# EAGLE design RCShield-v1 (EAGLE 5.07)
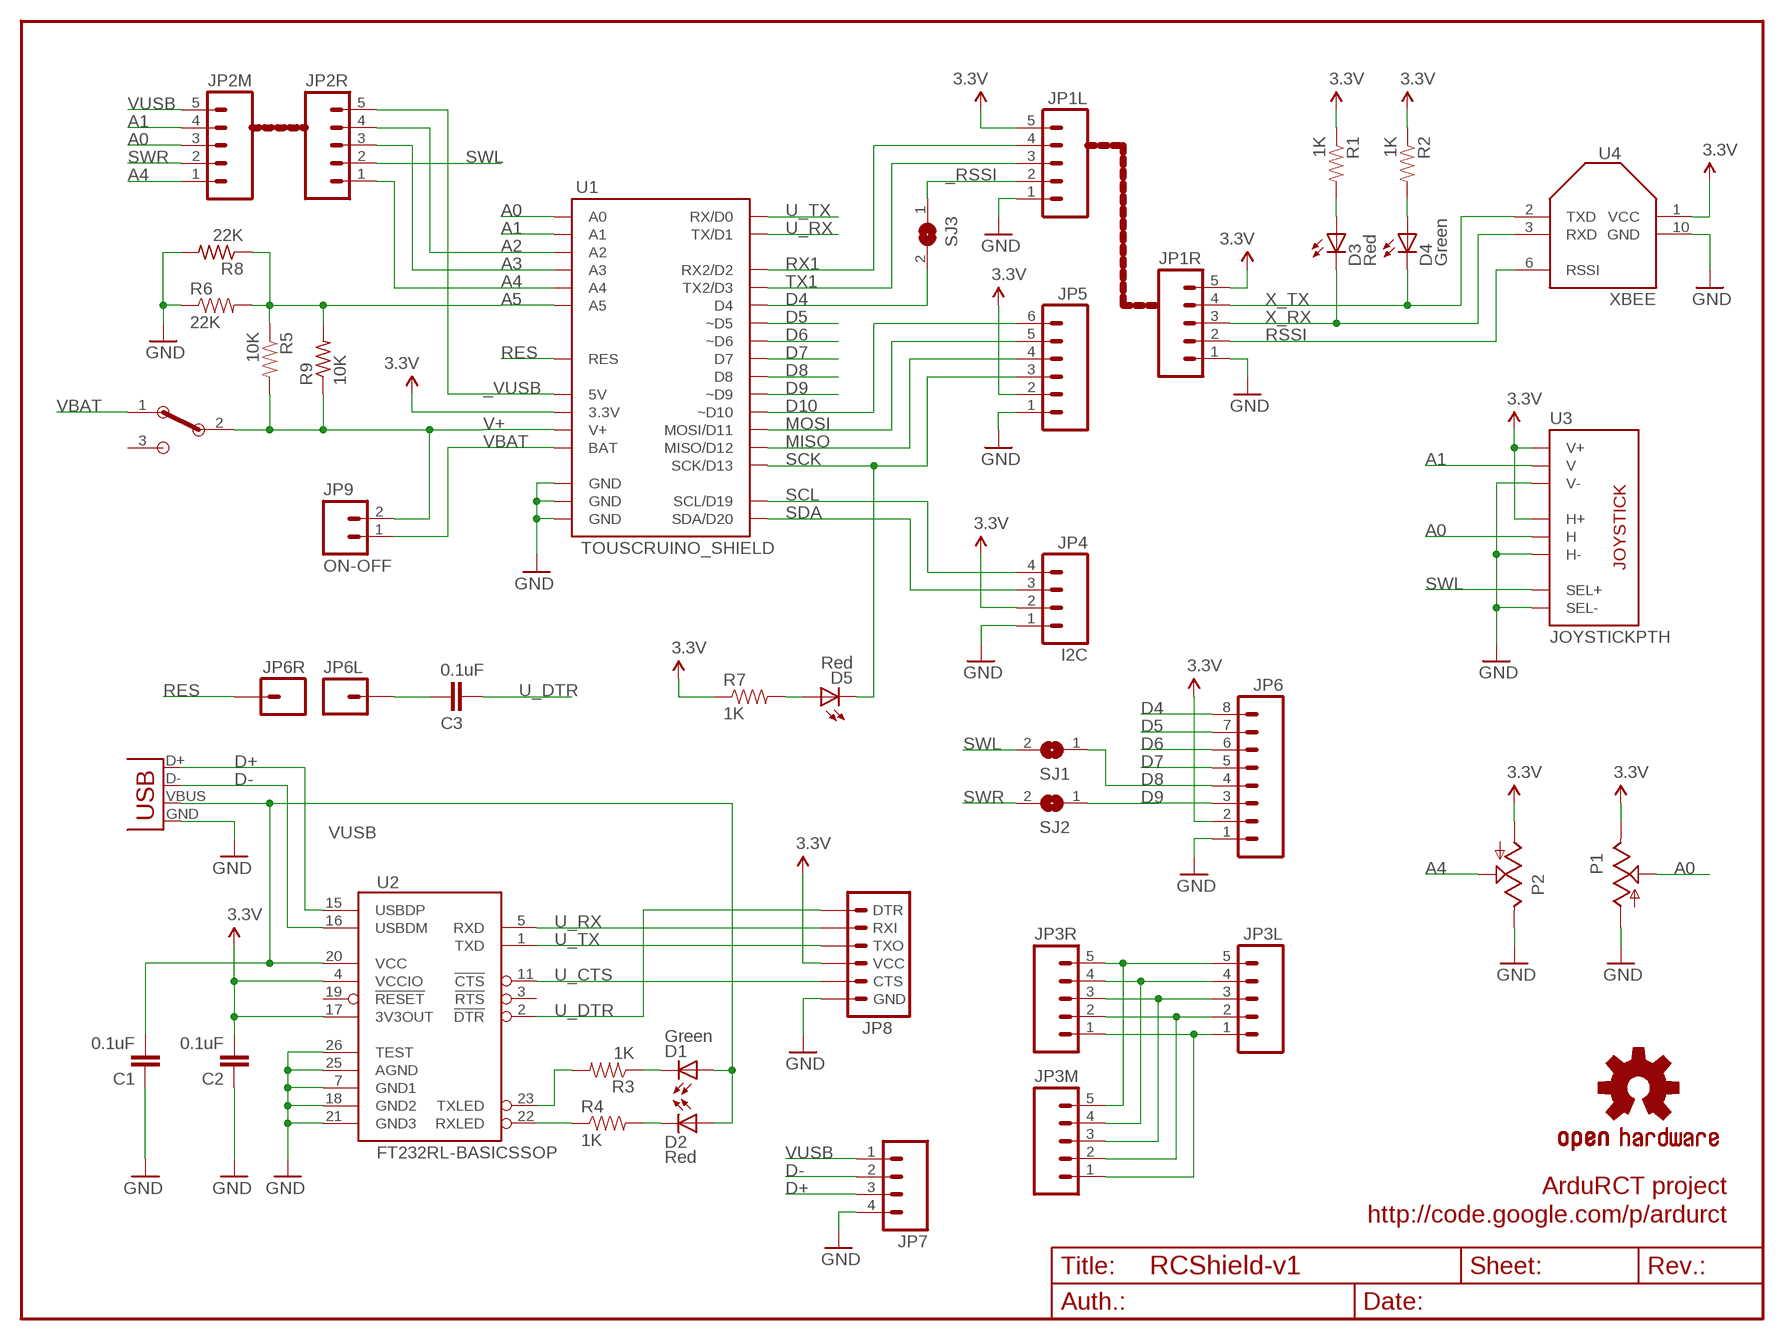
[diagram p0: schematic, sheet 1]

## Parts
C1  0.1uF  CAP0805  [0805]
C2  0.1uF  CAP0805  [0805]
C3  0.1uF  CAP0805  [0805]
D1  Green  LED  [LED]
D2  Red  LED  [LED]
D3  Red  LED  [LED]
D4  Green  LED  [LED]
D5  Red  LED  [LED]
JP1L  M05  [2+3]
JP1R  M05  [2+3]
JP2M  M05  [2+3]
JP2R  M05  [2+3]
JP3L  M05  [2+3]
JP3M  M05  [2+3]
JP3R  M05  [2+3]
JP4  I2C  M04  [1X04]
JP5  M06SIP  [1X06]
JP6  M08  [1X08]
JP6L  M01PTH  [1X01]
JP6R  M01PTH  [1X01]
JP7  M04  [1X04]
JP8  ARDUINO_SERIAL_PROGRAM  [1X06_F]
JP9  ON-OFF  M02  [1X02]
P1  POT  [ALPS_POT]
P2  POT  [ALPS_POT]
R1  1K  RESISTOR0805-RES  [0805]
R2  1K  RESISTOR0805-RES  [0805]
R3  1K  RESISTOR0805-RES  [0805]
R4  1K  RESISTOR0805-RES  [0805]
R5  10K  RESISTOR0805-RES  [0805]
R6  22K  RESISTOR0805-RES  [0805]
R7  1K  RESISTOR0805-RES  [0805]
R8  22K  R-US_0207/7  [0207/7]
R9  10K  R-US_0207/7  [0207/7]
S4  EG1224  [EG1224]
SJ1  SJ  [SJ]
SJ2  SJ  [SJ]
SJ3  SJ  [SJ]
U1  TOUSCRUINO_SHIELD  TOUSCRUINO_SHIELDSPLIT  [TOUSCRUINO_SHIELD_SPLIT]
U2  FT232RL-BASICSSOP  [SSOP28DB]
U3  JOYSTICKPTH  [JOYSTICK]
U4  XBEE  XBEE-RSSI  [XBEE-SMD]
U$1  OSHW-LOGOM  [OSHW-LOGO-M]
X1  USBSMD  [USB-MINIB]

## Nets
3.3V: C2.2 JP1L.5 JP1R.5 JP4.2 JP5.2 JP6.2 JP8.4(VCC) P1.P$1(E) P2.P$3(A) R1.1 R2.1 R7.1 U1.3.3V U2.4(VCCIO) U2.17(3V3OUT) U3.H1(H+) U3.V1(V+) U4.1(VCC)
_RSSI: JP1L.2 SJ3.1
_VUSB: JP2R.5 U1.5V
A0: JP2M.3 P1.P$2(S) U1.A0 U3.H2(H)
A1: JP2M.4 U1.A1 U3.V2(V)
A2: JP2R.4 U1.A2
A3: JP2R.3 U1.A3
A4: JP2M.1 JP2R.1 P2.P$2(S) U1.A4
A5: R5.1 R6.2 R8.1 R9.2 U1.A5
D4: JP6.8 SJ3.2 U1.D4
D5: JP6.7 U1.D5(~D5)
D6: JP6.6 U1.D6(~D6)
D7: JP6.5 U1.D7
D8: JP6.4 SJ1.1 U1.D8
D9: JP6.3 SJ2.1 U1.D9(~D9)
D10: JP5.6 U1.D10(~D10)
D+: JP7.3 U2.15(USBDP) X1.D+
D-: JP7.2 U2.16(USBDM) X1.D-
GND [vcc]: C1.1 C2.1 JP1L.1 JP1R.1 JP4.1 JP5.1 JP6.1 JP7.4 JP8.6(GND) P1.P$3(A) P2.P$1(E) R6.1 R8.2 U1.GND@0(GND) U1.GND@1(GND) U1.GND@2(GND) U2.7(GND1) U2.18(GND2) U2.21(GND3) U2.25(AGND) U2.26(TEST) U3.B2A(SEL-) U3.H3(H-) U3.V3(V-) U4.10(GND) X1.GND
MISO: JP5.4 U1.D12(MISO/D12)
MOSI: JP5.5 U1.D11(MOSI/D11)
N$4: JP3L.4 JP3M.4 JP3R.4
N$5: JP3L.3 JP3M.3 JP3R.3
N$6: JP3L.2 JP3M.2 JP3R.2
N$7: JP3L.5 JP3M.5 JP3R.5
N$8: D5.A1(A) R7.2
N$11: C3.2 JP6L.1
N$14: D3.A1(A) R1.2
N$18: R3.2 U2.23(TXLED)
N$22: R4.1 U2.22(RXLED)
N$25: D4.A1(A) R2.2
RES: JP6R.1 U1.RES
RSSI: JP1R.2 U4.6(RSSI)
RX1: JP1L.4 U1.D2(RX2/D2)
SCK: D5.C1(C) JP5.3 U1.D13(SCK/D13)
SCL: JP4.4 U1.SCL(SCL/D19)
SDA: JP4.3 U1.SDA(SDA/D20)
SWL: JP2R.2 SJ1.2 U3.B1A(SEL+)
SWR: JP2M.2 SJ2.2
TX1: JP1L.3 U1.D3(TX2/D3)
U_CTS: JP8.5(CTS) U2.11(!CTS)
U_DTR: C3.1 JP8.1(DTR) U2.2(!DTR)
U_RX: JP8.2(RXI) U1.TX(TX/D1) U2.5(RXD)
U_RX_LED: D2.C1(C) R4.2
U_TX: JP8.3(TXO) U1.RX(RX/D0) U2.1(TXD)
U_TX_LED: D1.C1(C) R3.1
V+: JP9.2 R5.2 R9.1 S4.2 U1.V+
VBAT: JP9.1 S4.1 U1.BAT
VGND [vcc]: JP3L.1 JP3M.1 JP3R.1
VUSB: C1.2 D1.A1(A) D2.A1(A) JP2M.5 JP7.1 U2.20(VCC) X1.VBUS
X_RX: D3.C1(C) JP1R.3 U4.3(RXD)
X_TX: D4.C1(C) JP1R.4 U4.2(TXD)
Unconnected: S4.3 U2.3(!RTS) U2.19(!RESET)

## Notes on the sheet
- ArduRCT project
- http://code.google.com/p/ardurct

## Library data of the parts
C1-C3 = SparkFun:CAP: Capacitor Standard 0603 ceramic capacitor, and 0.1" leaded capacitor.
D1-D5 = wibauxl:LED
JP1L JP1R JP2M JP2R JP3L JP3M JP3R = wibauxl:M05
JP4 JP7 = wibauxl:M04
JP5 = SparkFun:M06: Header 6 Standard 6-pin 0.1" header. Use with straight break away headers (SKU : PRT-00116), right angle break away headers (PRT-00553), swiss pins (PRT-00743), machine pins (PRT-00117), and female headers (PRT-00115). Molex polarized connector foot print use with SKU : PRT-08094 with associated crimp pins and housings. NOTES ON THE VARIANTS LOCK and LOCK_LONGPADS... This footprint was designed to help hold the alignment of a through-hole component (i.e. 6-pin header) while soldering it into place. You may notice that each hole has been shifted either up or down by 0.005 of an inch from it's more standard position (which is a perfectly straight line). This slight alteration caused the pins (the squares in the middle) to touch the edges of the holes. Because they are alternating, it causes a "brace" to hold the component in place. 0.005 has proven to be the perfect amount of "off-center" position when using our standard breakaway headers. Although looks a little odd when you look at the bare footprint, once you have a header in there, the alteration is very hard to notice. Also, if you push a header all the way into place, it is covered up entirely on the bottom side. This idea of altering the position of holes to aid alignment will be further integrated into the Sparkfun Library for other footprints. It can help hold any component with 3 or more connection pins.
JP6 = wibauxl:M08
JP6L JP6R = SparkFun:M01: Header 1 Standard 1-pin 0.1" header. Use with straight break away headers (SKU : PRT-00116), right angle break away headers (PRT-00553), swiss pins (PRT-00743), machine pins (PRT-00117), and female headers (PRT-00115).
JP8 = wibauxl:ARDUINO_SERIAL_PROGRAM
JP9 = wibauxl:M02
P1 P2 = SparkFun:POT
R1-R7 = SparkFun:RESISTOR: Resistor Basic schematic elements and footprints for 0603, 1206, and PTH resistors.
R8 R9 = resistor:R-US_: RESISTOR, American symbol
S4 = wibauxl:EG1224
SJ1-SJ3 = jumper:SJ: SMD solder JUMPER
U1 = wibauxl:TOUSCRUINO_SHIELD
U2 = wibauxl:FT232RL-BASIC: USB UART This is the simplified version of the FT232RL unit. Only what you need, nothing you don't. Spark Fun Electronics SKU : COM-00650
U3 = SparkFun:JOYSTICK: Thumb Joystick Joystick commonly found in PS2 controllers. Two pots and a select switch. Footprint proven. Spark Fun Electronics SKU : COM-09032
U4 = wibauxl:XBEE-RSSI
U$1 = SparkFun:OSHW-LOGO: Open Source Hardware Logo This logo indicates the piece of hardware it is found on incorporates a OSHW license and/or adheres to the definition of open source hardware found here: http://freedomdefined.org/OSHW
X1 = SparkFun:USB: USB Connectors USB-B-PTH is fully proven SKU : PRT-00139 USB-miniB is fully proven SKU : PRT-00587 USB-A-PCB is untested. USB-A-H is throughly reviewed, but untested. Spark Fun Electronics SKU : PRT-00437 USB-B-SMT is throughly reviewed, but untested. Needs silkscreen touching up. USB-A-S has not been used/tested USB-MB-H has not been used/tested

## Net classes
0 default: width 0.203 mm
1 vcc: width 0.254 mm

## Board
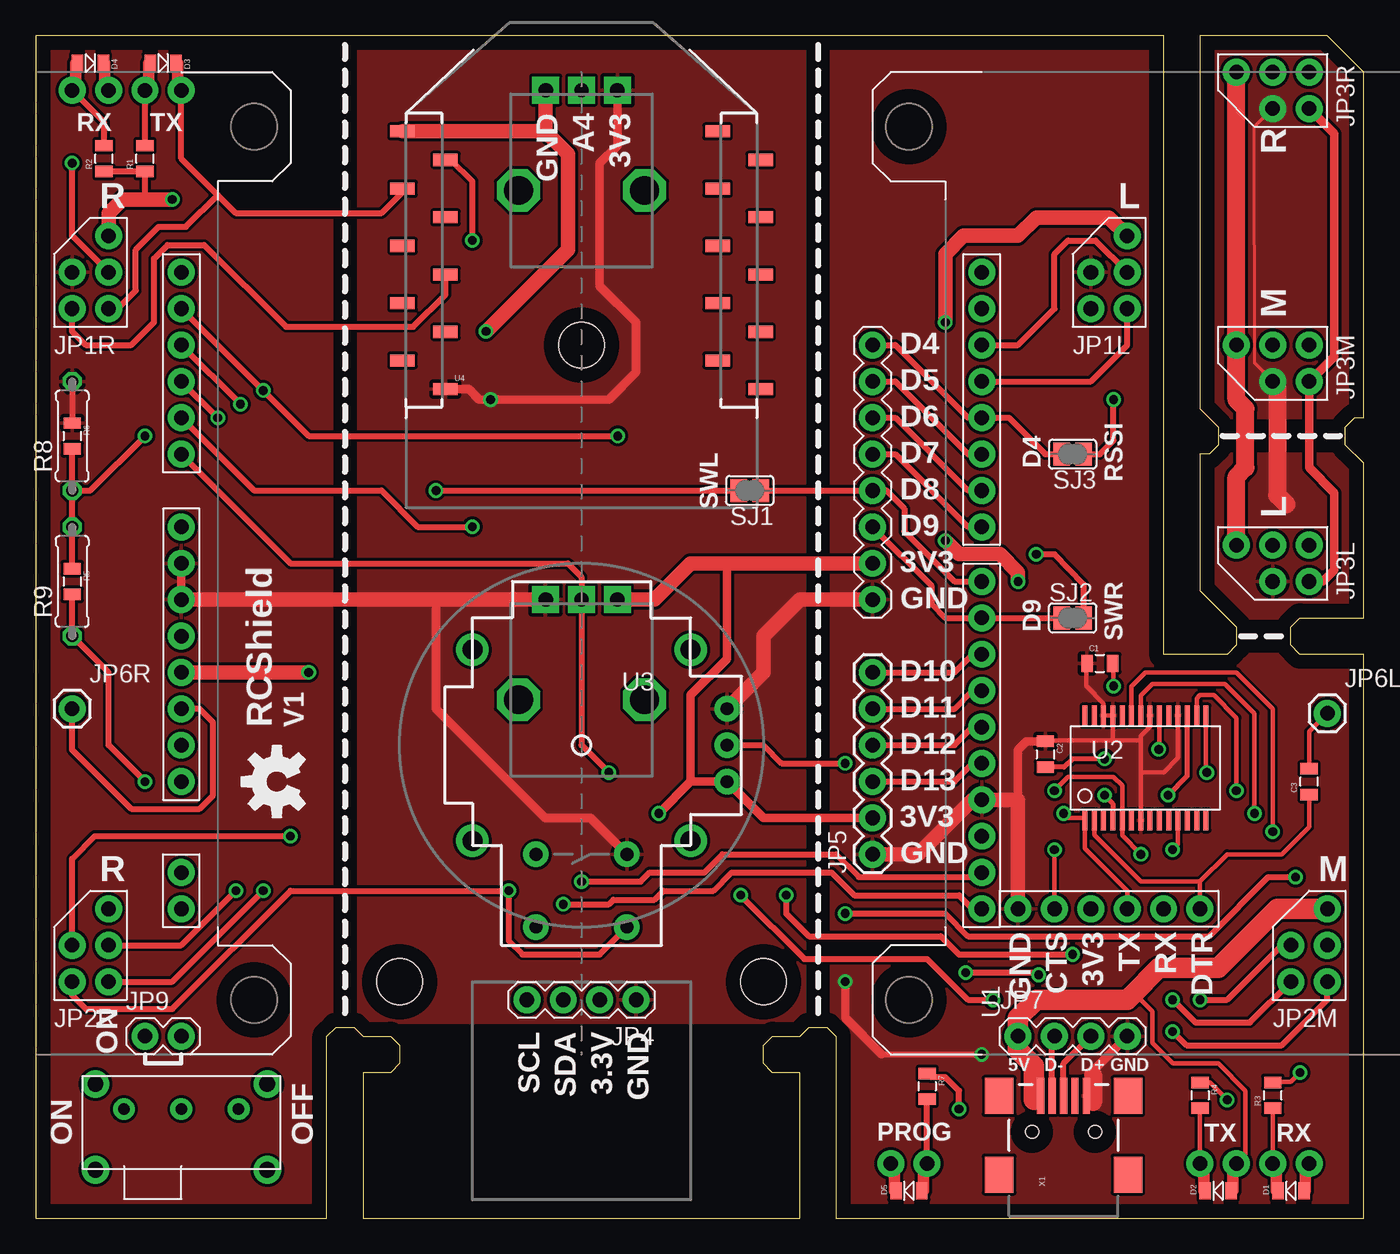
[diagram p1: board, top side]
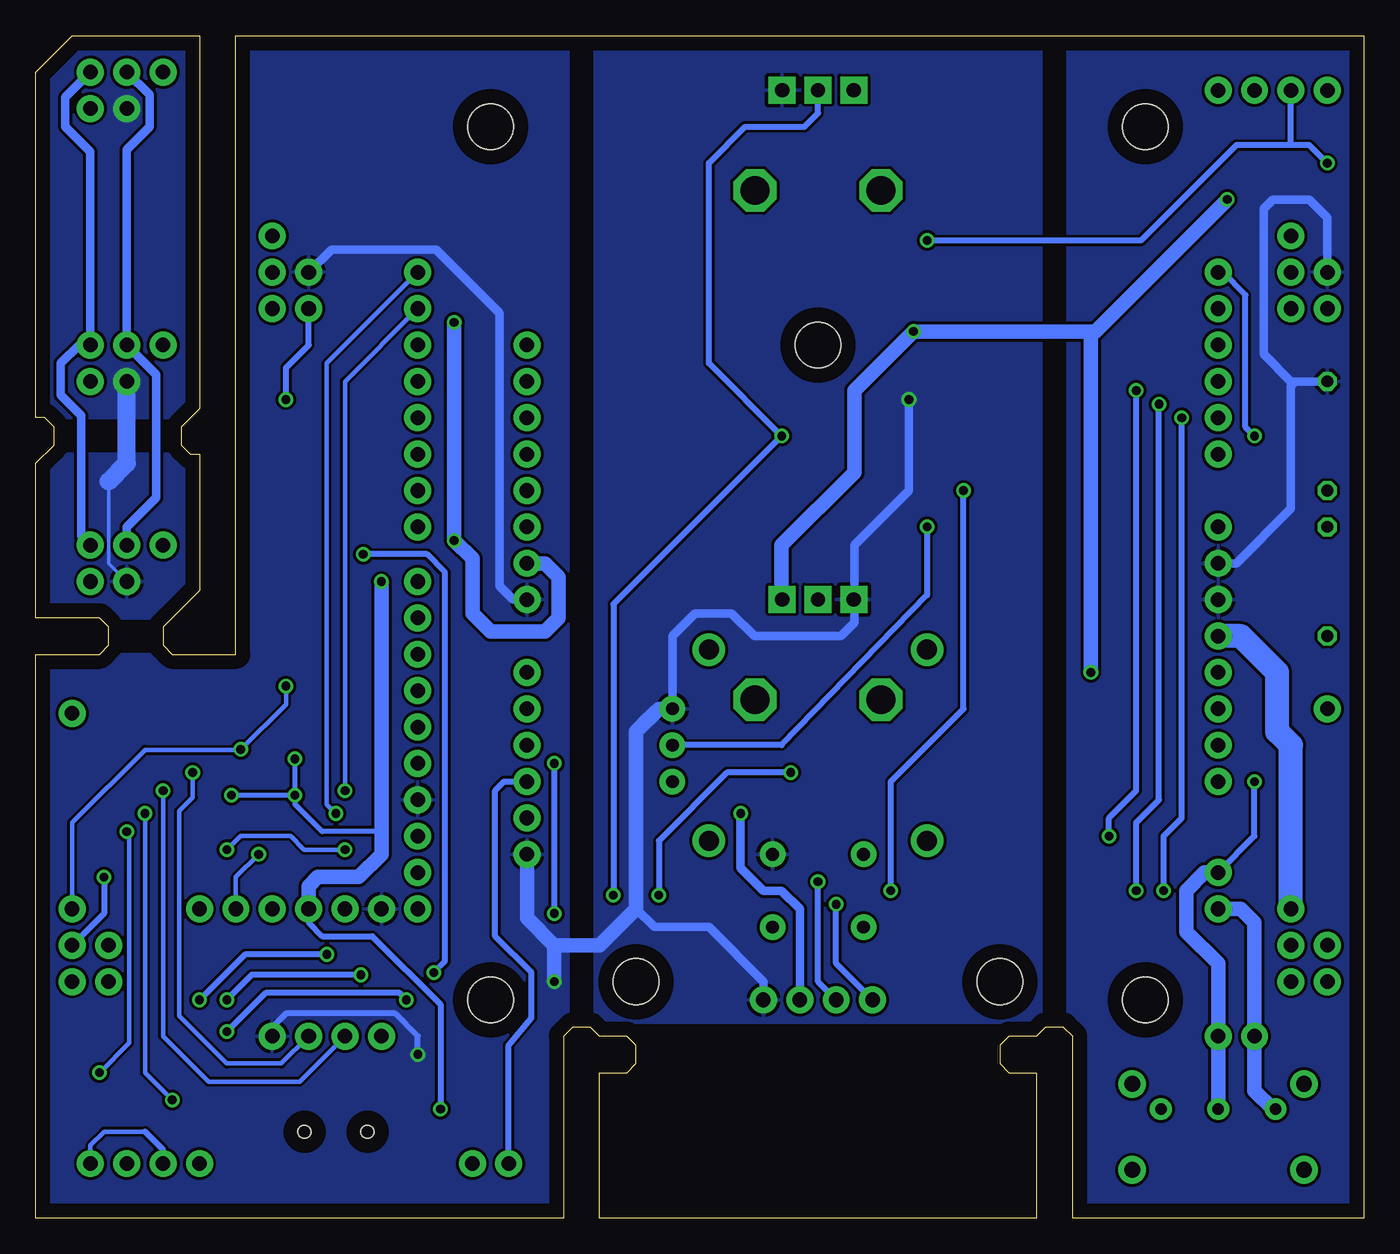
[diagram p2: board, bottom side, seen from below]

Size 92.71 x 82.55 mm. Coordinates in mm from the lower left corner, seen from the top.
Outline: 0,0 20.32,0 20.32,12.7 20.95,13.34 22.23,13.34 22.86,12.7 24.77,12.7 25.4,12.06 25.4,10.79 24.77,10.16 22.86,10.16 22.86,0 53.34,0 53.34,10.16 51.44,10.16 50.8,10.79 50.8,12.06 51.44,12.7 53.34,12.7 53.98,13.34 55.24,13.34 55.88,12.7 55.88,0 92.7,0 92.71,39.37 88.27,39.37 87.63,40.01 87.63,41.27 88.27,41.91 92.71,41.91 92.71,52.7 91.44,53.98 91.44,55.24 92.08,55.88 92.71,55.88 92.71,80.01 90.17,82.55 81.28,82.54 81.28,56.52 82.55,55.24 82.55,53.98 81.92,53.34 81.28,53.34 81.28,43.81 83.82,41.27 83.82,40.01 83.19,39.37 78.74,39.37 78.74,82.55 20.64,82.55 20.32,82.54 0,82.54 0,0
Copper layers (1*16): Top 0.035mm / dielectric 1.5mm / Bottom 0.035mm
Design rules "default *": minimum track width 10mil, minimum drill 24mil, track to track 8mil, track to pad 8mil, pad to pad 8mil, via to via 8mil, smd to smd 8mil, copper to edge 40mil, drill to drill 8mil, minimum pad ring 10mil, minimum via ring 8mil, stop-mask expansion 4mil, vias tented up to drill 0mil, thermal gap 10mil
Holes 3.2 mm at 15.24,15.24 60.96,15.24 60.96,76.2 15.24,76.2 50.8,16.51 25.4,16.51 38.1,60.96

### Footprints (pad centres in the part's own frame; a part is rotated, then mirrored left to right if it is on the bottom)
0805 = smd 0.8 x 1.2: 1 -0.9,0; 2 0.9,0
LED = smd 0.8 x 1.2: A -0.9,0; C 0.9,0 | drill 1.016 pad 1.88 round: A1 -1.27,-1.905; C1 1.27,-1.905
2+3 = drill 1.016 pad 1.88 round: 1 -1.27,0; 2 1.27,0; 3 1.27,2.54; 4 -1.27,2.54; 5 -3.81,2.54
1X04 = drill 1.016 pad 1.88 round: 1 0,0; 2 2.54,0; 3 5.08,0; 4 7.62,0
1X06 = drill 1.016 pad 1.88 round: 1 0,0; 2 2.54,0; 3 5.08,0; 4 7.62,0; 5 10.16,0; 6 12.7,0
1X08 = drill 1.016 pad 1.88 round: 1 0,0; 2 2.54,0; 3 5.08,0; 4 7.62,0; 5 10.16,0; 6 12.7,0; 7 15.24,0; 8 17.78,0
1X01 = drill 1.016 pad 1.88 round: 1 0,0
1X06_F = drill 1.016 pad 1.88 round: 1 0,0; 2 2.54,0; 3 5.08,0; 4 7.62,0; 5 10.16,0; 6 12.7,0
1X02 = drill 1.016 pad 1.88 round: 1 0,0; 2 2.54,0
ALPS_POT = drill 1 pad 1.88 square: P$1 7,-2.5; P$2 7,0; P$3 7,2.5 | drill 2 octagon: P$4 0,-4.4; P$5 0,4.4
0207/7 = drill 0.813 octagon: 1 -3.81,0; 2 3.81,0
EG1224 = drill 0.8 pad 1.524 round: 1 -4,0; 2 0,0; 3 4,0 | drill 1.1 pad 1.93 round: P$4 6,1.75; P$5 -6,1.75; P$6 -6,-4.25; P$7 6,-4.25
SJ = smd 1.168 x 1.6: 1 -0.762,0; 2 0.762,0
TOUSCRUINO_SHIELD_SPLIT = drill 1.016 pad 1.88 round: 3.3V -27.94,-8.89; 5V -27.94,-6.35; A0 -27.94,6.35; A1 -27.94,8.89; A2 -27.94,11.43; A3 -27.94,13.97; A4 -27.94,16.51; A5 -27.94,19.05; AREF 27.94,-20.32; BAT -27.94,-25.4; D2 27.94,13.97; D3 27.94,11.43; D4 27.94,8.89; D5 27.94,6.35; D6 27.94,3.81; D7 27.94,1.27; D8 27.94,-2.54; D9 27.94,-5.08; D10 27.94,-7.62; D11 27.94,-10.16; D12 27.94,-12.7; D13 27.94,-15.24; GND@0 -27.94,-3.81; GND@1 -27.94,-1.27; GND@2 27.94,-17.78; IOREF -27.94,-13.97; NC -27.94,-16.51; RES -27.94,-11.43; RX 27.94,19.05; SCL 27.94,-25.4; SDA 27.94,-22.86; TX 27.94,16.51; V+ -27.94,-22.86; VIN -27.94,1.27
SSOP28DB = smd 0.348 x 1.397: 1 -4.225,-3.656; 2 -3.575,-3.656; 3 -2.925,-3.656; 4 -2.275,-3.656; 5 -1.625,-3.656; 6 -0.975,-3.656; 7 -0.325,-3.656; 8 0.325,-3.656; 9 0.975,-3.656; 10 1.625,-3.656; 11 2.275,-3.656; 12 2.925,-3.656; 13 3.575,-3.656; 14 4.225,-3.656; 15 4.225,3.656; 16 3.575,3.656; 17 2.925,3.656; 18 2.275,3.656; 19 1.625,3.656; 20 0.975,3.656; 21 0.325,3.656; 22 -0.325,3.656; 23 -0.975,3.656; 24 -1.625,3.656; 25 -2.275,3.656; 26 -2.925,3.656; 27 -3.575,3.656; 28 -4.225,3.656
JOYSTICK = drill 0.9 pad 1.778 round: B1A -3.175,12.7; B1B 3.175,12.7; B2A -3.175,7.62; B2B 3.175,7.62 | drill 0.889 pad 1.778 round: H1 -2.54,-10.16; H2 0,-10.16; H3 2.54,-10.16; V1 -10.16,2.54; V2 -10.16,0; V3 -10.16,-2.54 | drill 1.397 pad 2.286 round: MOUNT1 -7.62,6.668; MOUNT2 -7.62,-6.668; MOUNT3 7.62,-6.668; MOUNT4 7.62,6.668
XBEE-SMD = smd 1.7 x 0.85: 1 -12.5,20; 2 -9.5,18; 3 -12.5,16; 4 -9.5,14; 5 -12.5,12; 6 -9.5,10; 7 -12.5,8; 8 -9.5,6; 9 -12.5,4; 10 -9.5,2; 11 12.5,2; 12 9.5,4; 13 12.5,6; 14 9.5,8; 15 12.5,10; 16 9.5,12; 17 12.5,14; 18 9.5,16; 19 12.5,18; 20 9.5,20
USB-MINIB = smd 2.5 x 0.5: D+ 2.5,0; D- 2.5,0.8; GND 2.5,-1.6; ID 2.5,-0.8; VBUS 2.5,1.6 | smd 2.5 x 2: MTN1 -3,4.5; MTN2 2.5,4.5; MTN3 -3,-4.5; MTN4 2.5,-4.5 | hole 0.9: 0,2.2; 0,-2.2

### Placement (x,y rotation side)
C1  74.3,38.73 0 top
C2  70.48,32.38 270 top
C3  88.9,30.48 90 top
D1  87.63,1.91 180 top
D2  82.55,1.91 180 top
D3  8.89,80.64 0 top
D4  3.81,80.64 0 top
D5  60.96,1.91 180 top
JP1L  73.66,64.77 270 top
JP1R  2.54,64.77 270 top
JP2M  87.63,17.78 270 top
JP2R  2.54,17.78 270 top
JP3L  87.63,44.45 0 top
JP3M  87.63,58.42 0 top
JP3R  87.63,77.47 0 top
JP4  41.91,15.24 180 top
JP5  58.42,25.4 90 top
JP6  58.42,43.18 90 top
JP6L  90.17,35.24 0 top
JP6R  2.54,35.56 0 top
JP7  68.58,12.7 0 top
JP8  81.28,21.59 180 top
JP9  7.62,12.7 0 top
P1  38.1,36.2 90 top
P2  38.1,71.75 90 top
R1  7.62,73.98 90 top
R2  4.76,73.98 90 top
R3  86.36,8.57 90 top
R4  81.28,8.57 270 top
R5  2.54,44.45 270 top
R6  2.54,54.61 270 top
R7  62.23,9.21 270 top
R8  2.54,54.61 90 top
R9  2.54,44.45 90 top
S4  10.16,7.62 0 top
SJ1  49.85,50.8 180 top
SJ2  72.39,41.91 0 top
SJ3  72.39,53.34 180 top
U1  38.1,46.99 0 top
U2  77.47,31.43 0 top
U3  38.1,33.02 180 top
U4  38.1,55.88 0 top
U$1  16.83,30.48 90 top
X1  71.75,6.03 90 top

### Tracks (layer width: path | path; a pad name or v marks a point on that pad's centre or on a via)
3.3V  (via drill 0.61)
  Top 0.356: U2.17 80.39,30.86 v79.06,29.53 | C2.2 71.81,31.48 72.39,32.07 v74.61,32.07 | U2.4 75.19,28.95 v74.61,29.53
  Top 0.406: R2.1 R1.1 7.62,71.12 6.03,71.12 | v64.45,7.62 64.45,8.89 63.5,9.84 62.49,9.84 R7.1 61.97,10.16 | P1.P$1 40.62,43.2 U3.H1
  Top 0.61: JP5.2 50.8,27.94 U3.V1 45.72,30.48 | 45.72,30.48 45.72,36.51 48.26,39.05 48.26,45.72 | 45.72,30.48 v43.5,28.26
  Top 1.016: JP1L.5 74.93,69.85 69.85,69.85 68.58,68.58 64.77,68.58 63.5,67.31 v63.5,62.55 | U1.3.3V v19.05,38.1 | JP1R.5 5.08,70.17 6.03,71.12 v9.53,71.12 | 35.56,75.88 U4.1 | 35.56,75.88 37.15,74.3 37.15,67.63 v31.43,61.91 | JP6.2 48.26,45.72 45.72,45.72 43.18,43.18 U3.H1 | P2.P$3 35.6,75.92 35.56,75.88 | v63.5,47.31 64.45,46.35 67.31,46.35 68.58,45.09 v68.58,44.45
  Bottom 0.356: v74.61,29.53 v79.06,29.53 | v74.61,29.53 v74.61,32.07 | v74.61,29.53 74.61,28.89 72.71,26.99 68.58,26.99
  Bottom 0.406: JP8.4 73.66,20.64 72.71,19.68 69.22,19.68 64.45,14.92 v64.45,7.62
  Bottom 0.61: JP4.2 39.37,21.59 40.64,22.86 41.91,22.86 43.5,24.45 v43.5,28.26
  Bottom 1.016: v19.05,38.1 19.05,61.91 | 19.05,61.91 v31.43,61.91 35.56,57.78 35.56,52.07 40.64,46.99 U3.H1 | 19.05,61.91 18.73,61.91 v9.53,71.12 | v63.5,62.55 v63.5,47.31 62.23,46.04 62.23,42.23 60.96,40.96 57.15,40.96 56.2,41.91 56.2,44.77 57.15,45.72 JP6.2 | v68.58,44.45 68.58,26.99 68.58,25.4 70.17,23.81 73.03,23.81 73.66,23.18 JP8.4
_RSSI  (via drill 0.61)
  Top 0.406: SJ3.1 73.47,53.78 73.34,53.34 74.3,53.34 75.25,54.29 v75.25,57.15
  Bottom 0.406: v75.25,57.15 75.25,59.37 73.66,60.96 JP1L.2
_VUSB
  Bottom 1.676: U1.5V 8.57,40.64 6.03,38.1 6.03,33.97 5.08,33.02 JP2R.5
A0  (via drill 0.61)
  Top 0.406: JP2M.3 90.17,15.24 87,12.06 80.33,12.06 v79.38,13.02 | v66.83,15.24 65.09,15.24 62.23,18.1 53.66,18.1 v49.21,22.54 | U1.A0 17.78,45.72 37.15,45.72 38.1,44.77 U3.H2 | v40.01,31.11 38.1,33.02 U3.H2 | U3.H2 P1.P$2
  Bottom 0.406: v79.38,13.02 76.68,15.72 67.31,15.72 v66.83,15.24 | v49.21,22.54 49.21,26.35 44.45,31.11 v40.01,31.11
A1  (via drill 0.61)
  Top 0.406: v87.95,23.81 86.04,23.81 81.92,19.68 65.09,19.68 63.5,21.27 v56.52,21.27 | U3.V2 50.8,33.02 52.07,31.75 v56.52,31.75 | v30.48,48.26 26.67,48.26 24.13,50.8 15.24,50.8 U1.A1
  Bottom 0.406: JP2M.4 87.95,21.27 v87.95,23.81 | v56.52,31.75 v56.52,21.27 | U3.V2 40.64,33.02 30.48,43.5 v30.48,48.26
A2  (via drill 0.61)
  Top 0.406: JP2R.4 10.16,19.05 v13.97,22.86 | v12.7,55.88 U1.A2
  Bottom 0.406: v13.97,22.86 13.97,26.67 12.7,27.94 v12.7,55.88
A3  (via drill 0.61)
  Top 0.406: JP2R.3 9.53,16.51 v15.88,22.86 | v14.29,56.83 U1.A3
  Bottom 0.406: v15.88,22.86 15.88,27.62 14.29,29.21 v14.29,56.83
A4  (via drill 0.61)
  Top 0.406: U1.A4 v15.88,57.78 19.05,54.61 v40.64,54.61 | JP2M.1 87,19.05 83.19,15.24 v81.28,15.24 | v72.39,18.41 64.45,18.41 63.18,19.68 53.98,19.68 52.39,21.27 v52.39,22.54 | v17.78,26.67 4.13,26.67 2.54,25.08 JP2R.1
  Bottom 0.406: v72.39,18.41 78.11,18.41 v81.28,15.24 | v17.78,26.67 17.78,27.94 15.88,29.84 v15.88,57.78 | P2.P$2 38.1,77.15 39.05,76.2 43.18,76.2 45.72,73.66 45.72,59.69 v40.64,54.61 52.39,42.86 v52.39,22.54
A5  (via drill 0.61)
  Top 0.406: v7.62,54.61 3.81,50.8 R8.1 | R8.1 R9.2 R5.1 | R8.1 R6.2
  Bottom 0.406: U1.A5 9.84,66.04 8.26,64.45 8.26,55.24 v7.62,54.61
D4
  Top 0.406: JP6.8 60.01,60.96 65.09,55.88 U1.D4 67.94,55.88 70.48,53.34 SJ3.2
D5
  Top 0.406: U1.D5 65.09,53.34 60.01,58.42 JP6.7
D6
  Top 0.406: U1.D6 65.09,50.8 60.01,55.88 JP6.6
D7
  Top 0.406: U1.D7 65.09,48.26 60.01,53.34 JP6.5
D8
  Top 0.406: U1.D8 64.14,44.45 60.64,47.94 60.64,49.53 59.37,50.8 JP6.4 SJ1.1
D9
  Top 0.406: JP6.3 62.55,44.13 62.55,42.86 63.5,41.91 U1.D9 SJ2.1
D10
  Top 0.406: JP5.6 64.14,38.1 65.41,39.37 U1.D10
D+  (via drill 0.61)
  Top 0.305: 81.69,35.15 U2.15 81.69,31.18 v81.76,31.11
  Top 0.406: X1.D+ 71.75,10.79 JP7.3
  Bottom 0.305: v81.76,31.11 81.76,29.37 82.07,29.05 82.71,28.42 82.71,24.29 82.71,14.13 79.38,10.79 75.56,10.79 JP7.3
D-  (via drill 0.61)
  Top 0.305: U2.16 81.05,36.28 81.28,36.51 82.23,36.51 83.82,34.92 v83.82,29.84
  Top 0.406: X1.D- 70.95,12.54 JP7.2
  Bottom 0.305: v83.82,29.84 83.82,12.7 80.64,9.53 74.3,9.53 JP7.2
GND  (via drill 0.61)
  Top 0.305: 77.15,33.34 77.15,33.66 77.8,34.3 U2.21 | C2.1 70.54,33.34 75.25,33.34 | 75.25,33.34 75.19,33.39 U2.25 U2.26 74.55,35.95 73.34,37.15 73.34,38.47 C1.1 | X1.GND 73.62,8.53 73.82,8.1 | 75.25,33.34 77.15,33.34 | 77.14,31.11 77.14,33.33 77.15,33.34 | 77.14,31.11 U2.7 | U2.18 79.75,32.12 78.74,31.11 77.14,31.11
  Top 0.406: 59.05,11.43 v66.04,11.43 | R8.2 R6.1
  Top 0.61: C2.1 69.16,33.28 68.58,32.7 68.58,29.21 | v56.52,16.51 56.52,13.97 59.05,11.43 | U1.GND@0 U1.GND@1 | P2.P$1 40.6,74.89 39.37,73.66 39.37,65.09 41.91,62.55 41.91,59.05 40.01,57.15 v31.75,57.15 30.96,57.15 30.26,57.88 28.89,57.88 | U3.B2A 38.73,27.94 35.56,27.94 27.94,35.56 27.94,43.18 | 34,43.18 U3.H3 | 28.89,57.88 U4.10 28.8,57.88 28.89,57.78 | 28.89,57.88 28.89,57.78 | 28.89,57.78 28.57,57.78 | 73.82,10 73.82,10.32 JP7.4
  Top 1.016: JP5.1 61.59,25.4 65.41,29.21 U1.GND@2 68.58,29.21 JP8.6 | JP6.1 53.34,43.18 50.8,40.64 50.8,38.1 U3.V3 | P1.P$3 34,43.18 27.94,43.18 U1.GND@0
  Top 1.27: 73.82,10 73.82,8.1
  Bottom 0.406: v66.04,11.43 66.04,12.7 67.63,14.29 75.25,14.29 76.2,13.34 JP7.4
  Bottom 0.61: JP1L.1 72.07,67.63 64.77,67.63 60.33,63.18 60.33,44.13 59.37,43.18 JP6.1 | U1.GND@1 8.89,45.72 5.08,49.53 5.08,58.1 4.76,58.42 R8.2 5.08,58.42 6.99,60.33 6.99,70.48 6.35,71.12 3.81,71.12 2.54,69.85 JP1R.1 | v31.75,57.15 31.75,50.8 35.56,46.99 U3.H3 | JP4.1 41.91,16.51 45.72,20.32 49.53,20.32 50.8,21.59 | 50.8,33.97 50.48,34.61 49.53,35.56 U3.V3 48.26,40.64 46.67,42.23 44.13,42.23 42.55,40.64 36.51,40.64 35.56,41.59 35.56,43.16 P1.P$3
  Bottom 1.016: 56.52,19.05 58.42,20.95 JP5.1 | U3.V3 49.21,35.56 50.8,33.97 50.8,21.59 53.34,19.05 56.52,19.05 | 56.52,19.05 v56.52,16.51
  pour Top: 0,82.55 20.64,82.55 20.64,0 0,0
  pour Bottom: 0,82.55 20.64,82.55 20.64,0 0,0
  pour Top: 22.54,82.55 53.66,82.55 53.66,13.65 22.54,13.65
  pour Top: 55.56,82.55 78.74,82.55 78.74,39.37 92.71,39.37 92.71,0 55.56,0
  pour Bottom: 55.56,82.55 78.74,82.55 78.74,39.37 92.71,39.37 92.71,0 55.56,0
  pour Bottom: 22.54,82.55 53.66,82.55 53.66,13.65 22.54,13.65
MISO
  Top 0.406: JP5.4 64.14,33.02 65.41,34.29 U1.D12
MOSI
  Top 0.406: JP5.5 64.14,35.56 65.41,36.83 U1.D11
N$4
  Bottom 0.61: JP3R.4 84.77,78.42 84.77,76.2 86.36,74.61 JP3M.4 84.3,58.9 84.3,56.99 84.3,51.28 84.3,50.32 85.72,48.9 86.36,48.26 JP3L.4
N$5
  Bottom 0.61: JP3R.3 90.65,78.26 90.65,76.2 88.9,74.45 JP3M.3 89.69,60.96 90.96,59.69 | 90.96,59.69 90.96,57.47 89.53,56.04 89.53,47.62 JP3L.3 | 90.96,59.69
N$6
  Top 0.61: JP3L.2 89.85,44.45 90.65,45.24 90.65,50.64 88.9,52.39 JP3M.2 90.65,60.17 90.65,75.72 JP3R.2
N$7
  Top 1.27: JP3L.5 83.82,51.75 84.45,52.39 84.45,56.52 83.82,57.15 JP3M.5 JP3R.5
N$8
  Top 0.406: D5.A1 R7.2
N$11
  Top 0.305: C3.2 88.9,33.97 JP6L.1
N$14
  Top 0.406: R1.2 D3.A1
N$18  (via drill 0.61)
  Top 0.305: U2.23 76.5,37.12 77.47,38.1 83.82,38.1 86.36,35.56 v86.36,26.99 | R3.2 86.36,9.53 87.63,9.53 v88.27,10.16
  Bottom 0.305: v86.36,26.99 86.2,26.67 86.2,12.22 v88.27,10.16
N$22  (via drill 0.61)
  Top 0.305: U2.22 77.14,36.51 77.95,37.31 83.03,37.31 85.09,35.24 v85.09,28.26 | R4.1 81.97,9.47 v83.19,8.26
  Bottom 0.305: v83.19,8.26 85.09,10.16 v85.09,28.26
N$25
  Top 0.406: R2.2 4.76,76.52 D4.A1
RES
  Top 0.406: JP6R.1 2.54,32.7 6.67,28.57 11.43,28.57 12.38,29.53 12.38,34.61 11.43,35.56 U1.RES
RSSI
  Top 0.406: JP1R.2 2.54,61.91 3.49,60.96 6.67,60.96 8.26,62.55 8.26,66.99 9.21,67.94 11.75,67.94 17.46,62.23 26.35,62.23 28.6,64.48 U4.6
RX1
  Top 0.406: U1.D2 68.58,60.96 71.12,63.5 71.12,67.31 72.07,68.26 73.98,68.26 JP1L.4
SCK
  Top 0.406: JP5.3 64.14,30.48 65.41,31.75 U1.D13
  Bottom 0.406: JP5.3 60.01,30.48 60.64,29.84 60.64,19.68 58.1,17.14 58.1,13.97 59.69,12.06 D5.C1
SCL  (via drill 0.61)
  Top 0.406: U1.SCL 65.41,21.59 64.45,22.54 57.15,22.54 55.56,24.13 48.58,24.13 47.31,22.86 43.81,22.86 43.18,22.23 40.32,22.23 40.01,21.91 v36.83,21.91
  Bottom 0.406: v36.83,21.91 36.83,17.78 JP4.4
SDA  (via drill 0.61)
  Top 0.406: U1.SDA 65.72,23.81 57.47,23.81 55.88,25.4 47.94,25.4 46.67,24.13 42.86,24.13 42.23,23.5 v38.1,23.5
  Bottom 0.406: v38.1,23.5 38.1,16.51 JP4.3
SWL  (via drill 0.61)
  Top 0.406: JP2R.2 2.54,15.56 3.49,14.61 9.53,14.61 17.78,22.86 v33.02,22.86 33.02,19.37 33.97,18.41 39.37,18.41 U3.B1A | 48.9,50.61 SJ1.2 v27.94,50.8
  Bottom 0.406: v27.94,50.8 27.94,35.56 33.02,30.48 v33.02,22.86
SWR  (via drill 0.61)
  Top 0.406: JP2M.2 84.77,13.65 80.96,13.65 v79.38,15.24 | v64.93,17.14 69.85,17.14 v70.01,16.99 | v70.01,16.99 | SJ2.2 73.15,44.26 71.12,46.35 v69.85,46.35
  Bottom 0.406: v79.38,15.24 77.63,16.99 v70.01,16.99 | v64.93,17.14 64.14,17.94 64.14,45.09 65.41,46.35 v69.85,46.35
TX1
  Top 0.406: U1.D3 73.66,58.42 75.56,60.33 76.2,60.96 JP1L.3
U_CTS  (via drill 0.61)
  Top 0.305: U2.11 79.75,26.09 v79.38,25.72 | JP8.5 v71.12,25.72
  Bottom 0.305: v71.12,25.72 73.98,25.72 74.93,26.67 78.42,26.67 79.06,26.04 v79.38,25.72
U_DTR
  Top 0.305: U2.2 73.89,26.75 77.15,23.5 81.28,23.5 | 81.28,23.5 JP8.1 | 81.28,23.5 83.19,25.4 87,25.4 88.9,27.3 C3.1
U_RX  (via drill 0.61)
  Top 0.305: v71.12,29.84 72.07,30.8 75.25,30.8 75.84,30.2 U2.5 75.84,26.71 v77.15,25.4
  Bottom 0.305: v71.12,29.84 71.12,58.42 U1.TX | v77.15,25.4 78.74,23.81 JP8.2
U_RX_LED
  Top 0.305: D2.C1 R4.2
U_TX  (via drill 0.61)
  Top 0.305: JP8.3 76.2,22.86 73.25,25.82 U2.1 73.25,27.88 73.18,27.94 72.07,27.94 v71.75,28.26
  Bottom 0.305: U1.RX 72.39,59.69 72.39,29.05 72.39,28.89 v71.75,28.26
U_TX_LED
  Top 0.305: D1.C1 R3.1
V+  (via drill 0.61)
  Top 0.406: v7.62,30.48 5.08,33.02 5.08,38.1 R9.1 R5.2
  Bottom 0.406: U1.V+ 7.62,26.67 v7.62,30.48
  Bottom 1.016: S4.2 JP9.2 10.16,17.78 12.38,20 12.38,22.86 11.11,24.13 U1.V+
VBAT
  Bottom 0.61: S4.1 6.35,7.62
  Bottom 1.016: 6.35,7.62 7.62,8.89 JP9.1 7.62,20.64 8.57,21.59 U1.BAT
VGND
  Top 0.203: 85.09,59.69 85.09,76.2
  Top 0.254: 85.09,76.2 JP3R.1 | JP3M.1 85.09,59.69 | 87.31,49.85 87.63,49.53
  Top 1.27: JP3M.1 86.68,58.1 86.68,50.48 87.31,49.85
  Bottom 0.254: JP3L.1 87.63,45.72 87.63,48.26 87.63,51.44
  Bottom 1.27: 87.63,51.44 86.36,52.7 JP3M.1
  pour Bottom (no thermals): 81.28,82.55 90.17,82.55 92.71,80.01 92.71,55.88 81.28,55.88
  pour Top (no thermals): 81.28,82.55 90.17,82.55 92.71,80.01 92.71,55.88 81.28,55.88
  pour Bottom: 81.28,53.34 92.71,53.34 92.71,41.91 83.82,41.91 81.28,44.45
  pour Top: 81.28,53.34 92.71,53.34 92.71,41.91 83.82,41.91 81.28,44.45
VUSB  (via drill 0.61)
  Top 0.305: U2.20 78.44,33.04 v78.4,32.73 | X1.VBUS 69.89,8.53 69.69,8.26 | D2.A1 84.45,4.45 84.45,8.89 82.55,10.79 79.38,10.79 77.95,12.22 77.95,14.45 76.83,15.56 76.52,15.56 | v75.25,37.15 75.25,38.73 C1.2
  Top 1.422: 69.69,8.26 69.69,10.64 68.58,11.75 JP7.1 68.58,13.97 69.85,15.24 76.2,15.24 76.52,15.56 78.42,17.46 82.55,17.46 86.68,21.59 JP2M.5
  Bottom 0.305: JP2M.5 90.17,27.62 85.09,32.7 78.42,32.7 v78.4,32.73 75.25,35.88 v75.25,37.15 | 85.09,6.03 87.95,6.03 88.9,5.08 D1.A1
  Bottom 0.406: 85.09,6.03 83.82,4.76 D2.A1
X_RX
  Top 0.406: 25.6,71.64 U4.3 | 25.6,71.64 24.13,70.17 13.97,70.17 12.7,71.44 | 25.6,71.64 26.04,72.07 | 12.7,71.44 10.16,73.98 D3.C1 | JP1R.3 5.71,63.5 6.99,64.77 6.99,67.63 8.57,69.22 10.48,69.22 12.7,71.44
X_TX  (via drill 0.61)
  Top 0.406: U4.2 28.99,73.88 30.48,72.39 v30.48,68.26 | JP1R.4 2.54,68.58 v2.54,73.66
  Bottom 0.406: v30.48,68.26 15.56,68.26 8.89,74.93 5.08,74.93 | 5.08,74.93 D4.C1 | 5.08,74.93 3.81,74.93 v2.54,73.66

### Text on the board
tPlace: GND | A4 | 3V3 | RX | TX | R | R | L | M | D4 | D5 | D6 | D7 | D4 | RSSI | SWL | D8 | L | D9 | 3V3 | GND | D9 | SWR | D10 | D11 | RCShield | V1 | D12 | D13 | 3V3 | GND | R | M | GND | CTS | 3V3 | TX | RX | DTR | SCL | SDA | 3.3V | GND | ON | 5V | D- | D+ | GND | ON | OFF | PROG | TX | RX